# EAGLE design MotorModule (EAGLE 9.4.0)
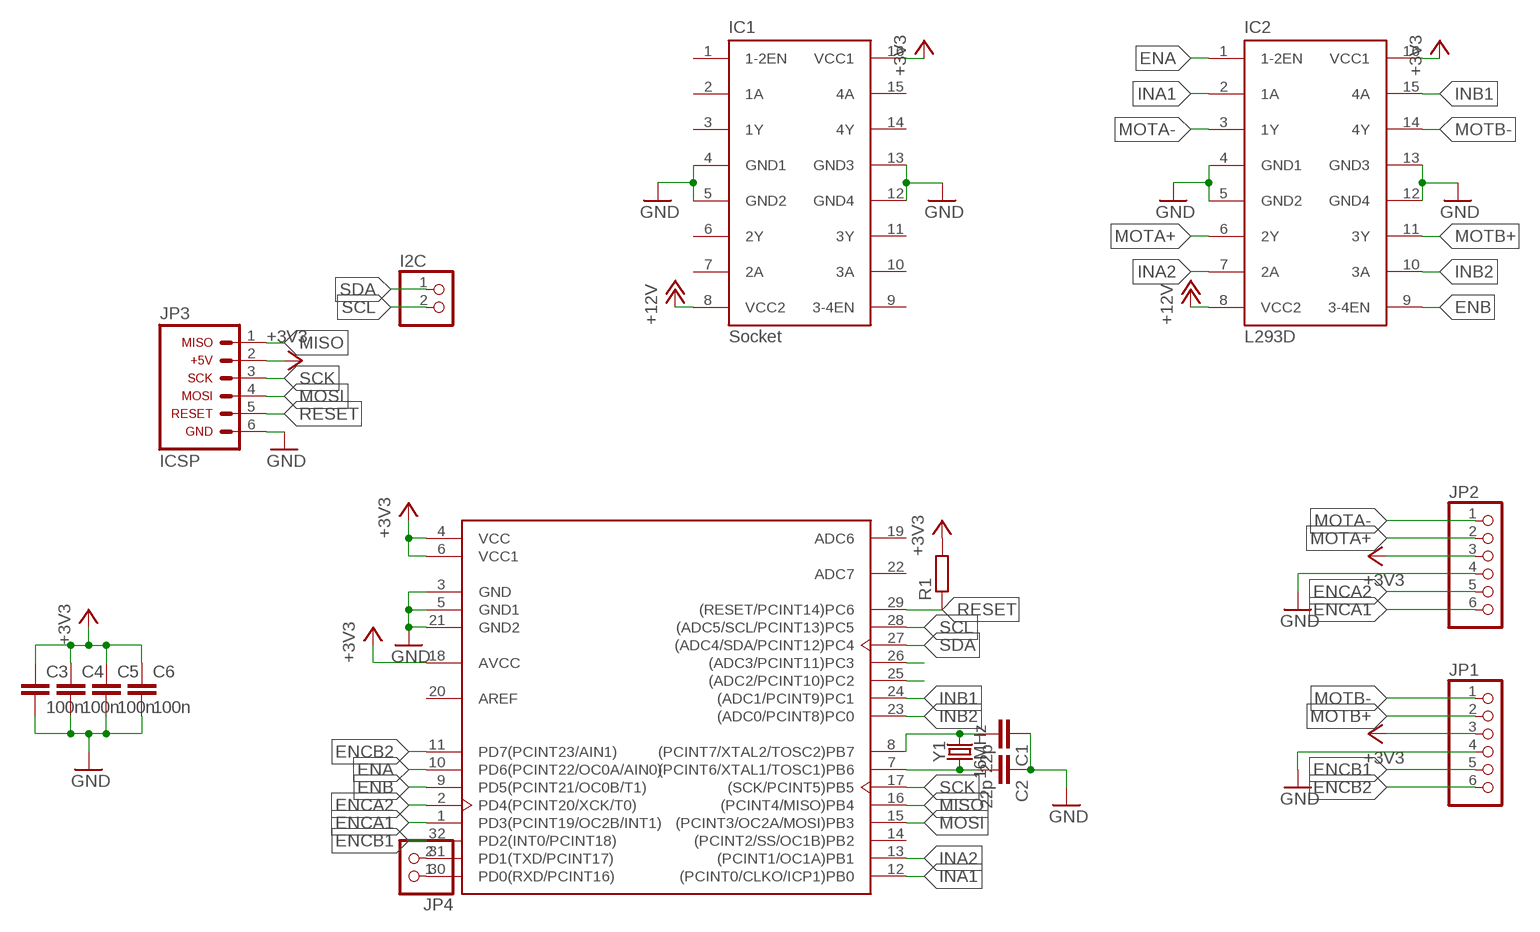
[diagram p0: schematic, sheet 1]

## Parts
C1  22p  C-EUC1206  [C1206]
C2  22p  C-EUC1206  [C1206]
C3  100n  C-EUC1206  [C1206]
C4  100n  C-EUC1206  [C1206]
C5  100n  C-EUC1206  [C1206]
C6  100n  C-EUC1206  [C1206]
I2C  PINHD-1X2  [1X02]
IC1  Socket  L293D  [L293]
IC2  L293D  [L293]
JP1  PINHD-1X6/90  [1X06/90]
JP2  PINHD-1X6/90  [1X06/90]
JP3  ICSP_HEADER  [ICSP_HEADER]
JP4  PINHD-1X2  [1X02]
R1  R-EU_M1206  [M1206]
U1  ATMEGA328P-AU  [TQFP-32]
Y1  16MHz  CRYSTAL-16MHZSMD-5X3.2  [CRYSTAL-SMD-5X3.2-4PAD]

## Nets
+3V3: C3.1 C4.1 C5.1 C6.1 IC1.16(VCC1) IC2.16(VCC1) JP1.3 JP2.3 JP3.2 R1.2 U1.4(VCC) U1.6(VCC1) U1.18(AVCC)
+12V: IC1.8(VCC2) IC2.8(VCC2)
ENA: IC2.1(1-2EN) U1.10(PD6(PCINT22/OC0A/AIN0))
ENB: IC2.9(3-4EN) U1.9(PD5(PCINT21/OC0B/T1))
ENCA1: JP2.6 U1.1(PD3(PCINT19/OC2B/INT1))
ENCA2: JP2.5 U1.2(PD4(PCINT20/XCK/T0))
ENCB1: JP1.5 U1.32(PD2(INT0/PCINT18))
ENCB2: JP1.6 U1.11(PD7(PCINT23/AIN1))
GND: C1.1 C2.1 C3.2 C4.2 C5.2 C6.2 IC1.4(GND1) IC1.5(GND2) IC1.12(GND4) IC1.13(GND3) IC2.4(GND1) IC2.5(GND2) IC2.12(GND4) IC2.13(GND3) JP1.4 JP2.4 JP3.6 U1.3(GND) U1.5(GND1) U1.21(GND2)
INA1: IC2.2(1A) U1.12((PCINT0/CLKO/ICP1)PB0)
INA2: IC2.7(2A) U1.13((PCINT1/OC1A)PB1)
INB1: IC2.15(4A) U1.24((ADC1/PCINT9)PC1)
INB2: IC2.10(3A) U1.23((ADC0/PCINT8)PC0)
MISO: JP3.1 U1.16((PCINT4/MISO)PB4)
MOSI: JP3.4 U1.15((PCINT3/OC2A/MOSI)PB3)
MOTA+: IC2.6(2Y) JP2.2
MOTA-: IC2.3(1Y) JP2.1
MOTB+: IC2.11(3Y) JP1.2
MOTB-: IC2.14(4Y) JP1.1
N$1: C1.2 U1.8((PCINT7/XTAL2/TOSC2)PB7) Y1.3
N$2: C2.2 U1.7((PCINT6/XTAL1/TOSC1)PB6) Y1.1
N$3: JP4.1 U1.30(PD0(RXD/PCINT16))
N$4: JP4.2 U1.31(PD1(TXD/PCINT17))
N$7: U1.25((ADC2/PCINT10)PC2)
N$8: U1.26((ADC3/PCINT11)PC3)
RESET: JP3.5 R1.1 U1.29((RESET/PCINT14)PC6)
SCK: JP3.3 U1.17((SCK/PCINT5)PB5)
SCL: I2C.2 U1.28((ADC5/SCL/PCINT13)PC5)
SDA: I2C.1 U1.27((ADC4/SDA/PCINT12)PC4)
Unconnected: IC1.1(1-2EN) IC1.2(1A) IC1.3(1Y) IC1.6(2Y) IC1.7(2A) IC1.9(3-4EN) IC1.10(3A) IC1.11(3Y) IC1.14(4Y) IC1.15(4A) U1.14((PCINT2/SS/OC1B)PB2) U1.19(ADC6) U1.22(ADC7)

## Power pins joined to a net without a drawn wire
AREF: U1.20(AREF)

## Library data of the parts
C1-C6 = rcl:C-EU: CAPACITOR, European symbol; SPICEPREFIX: C
I2C JP4 = pinhead:PINHD-1X2: PIN HEADER
IC1 IC2 = Cing Library:L293D: PUSH-PULL 4 CHANNEL DRIVER; MPN: L293D; OC_FARNELL: 9589619; OC_NEWARK: 56P8249
JP1 JP2 = pinhead:PINHD-1X6: PIN HEADER
JP3 = Cing Library:ICSP_HEADER: Arduino ICSP I/O Header This is the ICSP I/O header on the Arduino Uno R3. This connector is labeled with the following pin assignments: MISO +5V SCK MOSI RESET GND NOTE: Be sure you install this connector with the correct orientation on your PCB layout. Pin 1 has a square pad to assist with orientation.
R1 = rcl:R-EU_: RESISTOR, European symbol; SPICEPREFIX: R
U1 = Microcontroller:ATMEGA328P-AU: IC MCU 8BIT 32KB FLASH 32TQFP Manufacturer's datasheet <http://ww1.microchip.com/downloads/en/DeviceDoc/ATmega48A-PA-88A-PA-168A-PA-328-P-DS-DS40002061A.pdf>; CREATED_BY: PCBLayout.com; DIGIKEY_PART_NUMBER: ATMEGA328P-AU-ND; MANUFACTURER: Microchip Technology; MPN: ATMEGA328P-AU; PACKAGE: TQFP-32
Y1 = SparkFun-Clocks:CRYSTAL-16MHZ: 16MHz Crystal Digikey Example <http://www.digikey.com/product-search/en?keywords=535-9122-1-ND> Frequency: 16MHz Frequency Stability: ±50ppm Frequency Tolerance: ±20ppm Load Capacitance: 18pF SparkFun Products: Pro Micro -5V/16MHz <https://www.sparkfun.com/products/12640> SparkFun Serial Enabled LCD Kit <https://www.sparkfun.com/products/10097>; PROD_ID: XTAL-08218; SF_ID: COM-00094

## Board
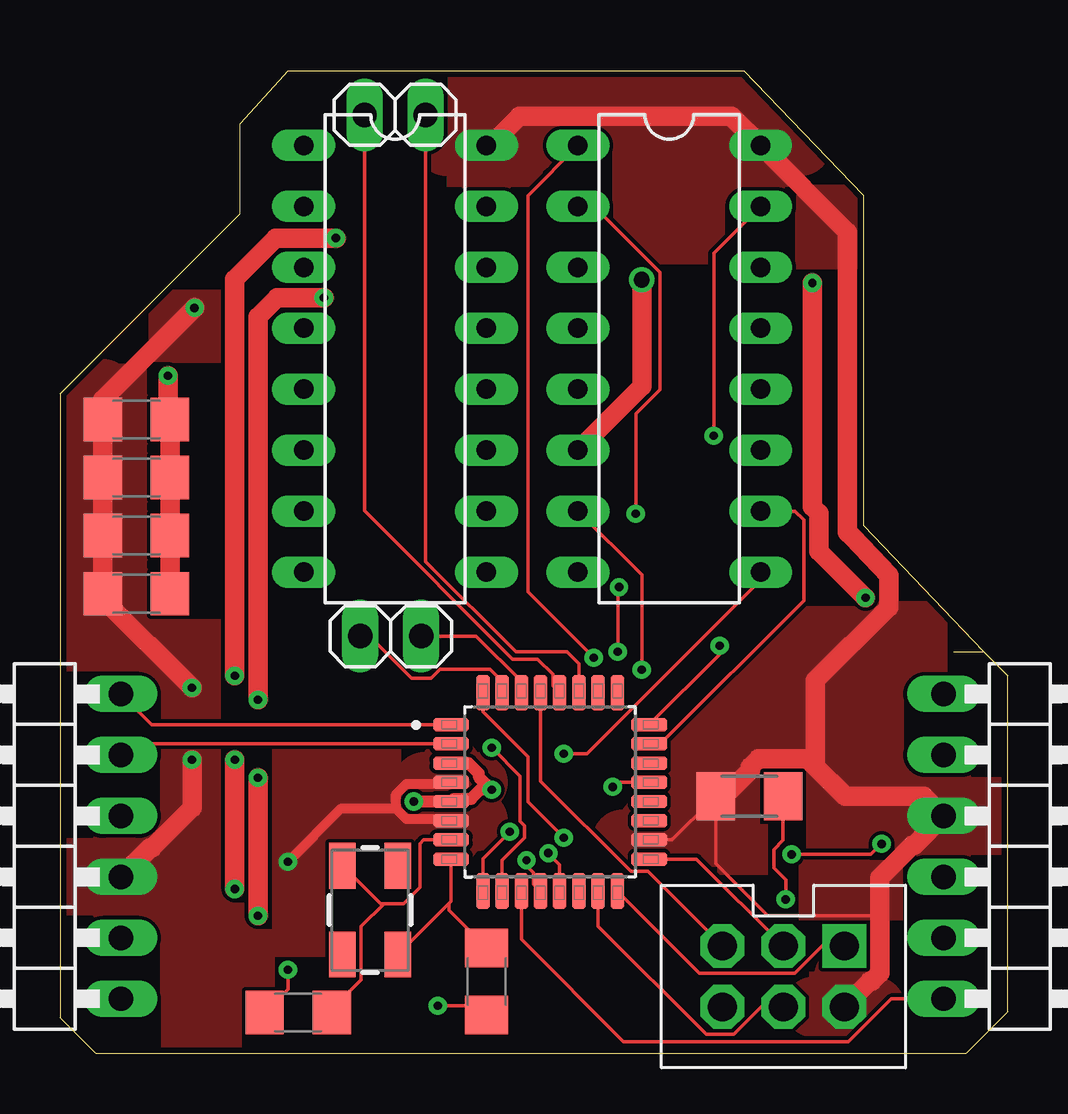
[diagram p1: board, top side]
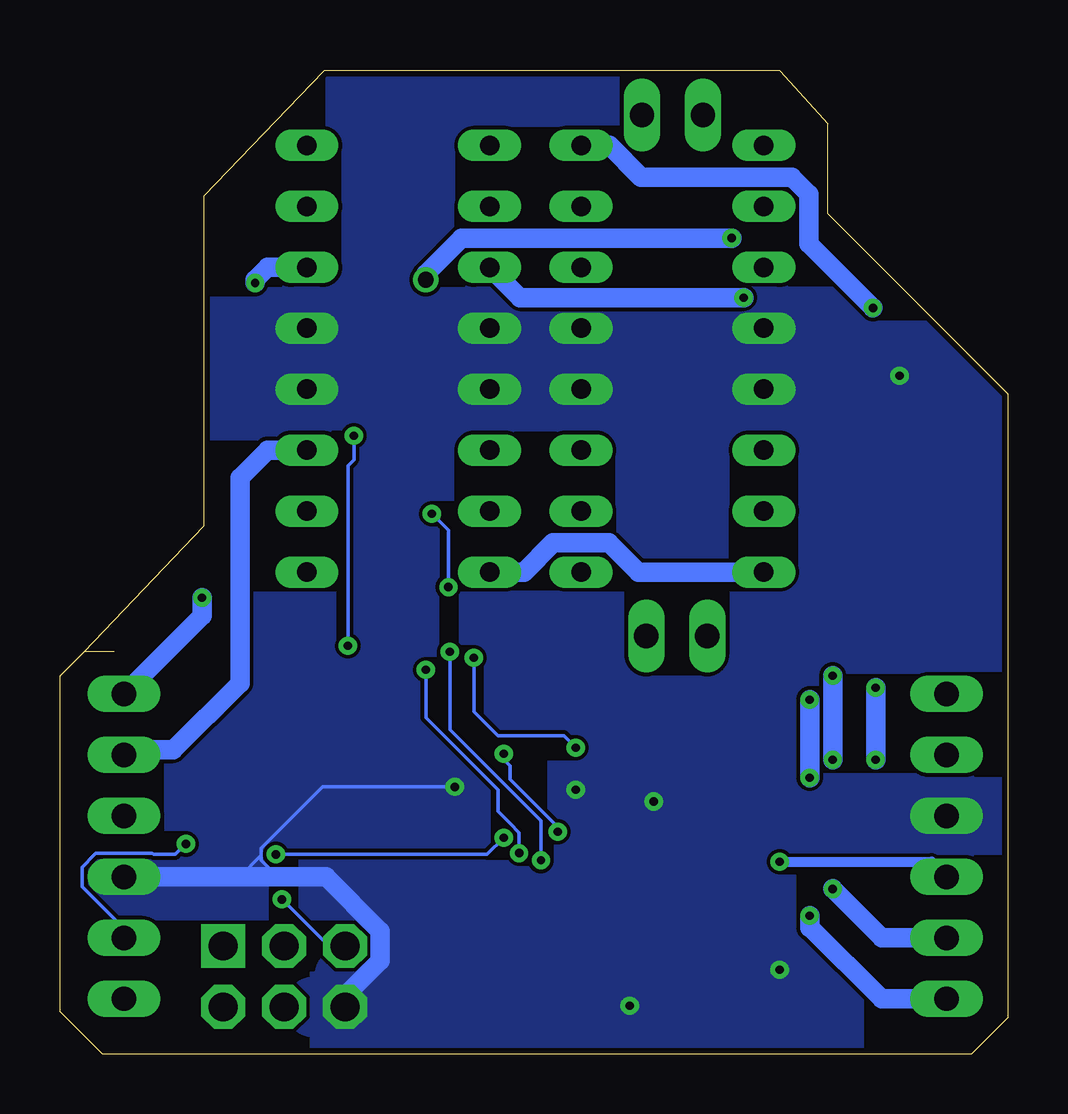
[diagram p2: board, bottom side, seen from below]

Size 39.5 x 40.95 mm. Coordinates in mm from the lower left corner, seen from the top.
Outline: 37.25,16.75 38.5,16.75
Outline: 38.5,16.75 39.5,15.75 39.5,1.75 37.75,0 1.5,0 0,1.5 0,27.5 7.5,35 7.5,38.75 9.5,40.95 28.5,40.95 33.5,35.75 33.5,22 38.5,16.75
Copper layers (1*16): Top 0.035mm / dielectric 1.5mm / Bottom 0.035mm
Design rules "default *": minimum track width 6mil, minimum drill 0.35mm, track to track 6mil, track to pad 6mil, pad to pad 6mil, via to via 6mil, smd to smd 6mil, copper to edge 10mil, drill to drill 6mil, minimum pad ring 10mil, minimum via ring 8mil, stop-mask expansion 4mil, vias tented up to drill 0mil, thermal gap 10mil

### Footprints (pad centres in the part's own frame; a part is rotated, then mirrored left to right if it is on the bottom)
C1206 = smd 1.6 x 1.8: 1 -1.4,0; 2 1.4,0
1X02 = drill 1.016 long: 1 -1.27,0; 2 1.27,0
L293 = drill 0.813 long: 1 -8.89,-3.81; 2 -6.35,-3.81; 3 -3.81,-3.81; 4 -1.27,-3.81; 5 1.27,-3.81; 6 3.81,-3.81; 7 6.35,-3.81; 8 8.89,-3.81; 9 8.89,3.81; 10 6.35,3.81; 11 3.81,3.81; 12 1.27,3.81; 13 -1.27,3.81; 14 -3.81,3.81; 15 -6.35,3.81; 16 -8.89,3.81
1X06/90 = drill 1.016 long: 1 -6.35,-3.81; 2 -3.81,-3.81; 3 -1.27,-3.81; 4 1.27,-3.81; 5 3.81,-3.81; 6 6.35,-3.81
ICSP_HEADER = drill 1.2 pad 1.829 square: 1 -1.27,2.54 | drill 1.2 pad 1.829 octagon: 2 1.27,2.54; 3 -1.27,0; 4 1.27,0; 5 -1.27,-2.54; 6 1.27,-2.54
M1206 = smd 1.6 x 2: 1 -1.4,0; 2 1.4,0
TQFP-32 = smd 0.57 x 1.5: 1 -2.8,-4.13; 2 -2,-4.13; 3 -1.2,-4.13; 4 -0.4,-4.13; 5 0.4,-4.13; 6 1.2,-4.13; 7 2,-4.13; 8 2.8,-4.13; 17 2.8,4.13; 18 2,4.13; 19 1.2,4.13; 20 0.4,4.13; 21 -0.4,4.13; 22 -1.2,4.13; 23 -2,4.13; 24 -2.8,4.13 | smd 1.5 x 0.57: 9 4.13,-2.8; 10 4.13,-2; 11 4.13,-1.2; 12 4.13,-0.4; 13 4.13,0.4; 14 4.13,1.2; 15 4.13,2; 16 4.13,2.8; 25 -4.13,2.8; 26 -4.13,2; 27 -4.13,1.2; 28 -4.13,0.4; 29 -4.13,-0.4; 30 -4.13,-1.2; 31 -4.13,-2; 32 -4.13,-2.8
CRYSTAL-SMD-5X3.2-4PAD = smd 1.9 x 1.1: 1 -1.85,-1.15; 2 1.85,-1.15; 3 1.85,1.15; 4 -1.85,1.15

### Placement (x,y rotation side)
C1  17.78,3.01 90 top
C2  9.93,1.72 0 top
C3  3.19,19.17 0 top
C4  3.19,21.59 0 top
C5  3.19,24.01 0 top
C6  3.19,26.43 0 top
I2C  13.97,39.12 180 top
IC1  13.97,28.96 270 top
IC2  25.4,28.96 270 top
JP1  40.64,8.64 270 top
JP2  -1.27,8.64 90 top
JP3  30.16,3.22 270 top
JP4  13.79,17.4 180 top
R1  28.74,10.73 180 top
U1  20.43,10.91 270 top
Y1  12.93,5.98 270 top

### Tracks (layer width: path | path; a pad name or v marks a point on that pad's centre or on a via)
+3V3  (via drill 0.35)
  Top 0.152: U1.18 25.52,8.91 27.18,10.57 | R1.2 27.34,7.91 29.5,5.75 34.17,5.75
  Top 0.406: 14.02,10.21 14.45,9.78 16.23,9.78 U1.6 | 14.02,10.21 14.02,10.81 14.45,11.24 16.23,11.24 U1.4 | 14.02,10.21 11.71,10.21 v9.5,8
  Top 0.61: 27.69,10.73 R1.2
  Top 0.813: JP3.2 33.77,3.02 33.85,3.02 34.17,3.34 34.17,5.75 34.17,7.34 35.52,8.69 35.61,8.69 JP1.3 36.01,10.73 32.73,10.73 31.5,11.96 | JP2.3 3.76,8.59 3.85,8.59 5.5,10.24 v5.5,12.25 | v5.5,15.25 1.79,18.96 C3.1 C4.1 C5.1 C6.1 1.79,27.25 v5.61,31.08 | 31.5,11.96 31.5,15.55 34.55,18.6 34.55,19.95 33.03,21.54 32.83,21.73 32.83,34.23 IC2.16 27.99,39.07 19.16,39.07 17.9,37.82 17.87,37.85 IC1.16 | 31.5,11.96 31.17,12.29 29.11,12.29 28.78,11.96 28.78,11.82 27.69,10.73 | R1.2 27.18,10.57
  Bottom 0.406: v9.5,8 3.17,8 JP2.3
  Bottom 0.813: v5.5,12.25 v5.5,15.25 | IC1.16 16.6,37.85 15.28,36.53 8.99,36.53 8.28,35.81 8.28,33.75 v5.61,31.08
  pour Top: -10,49.75 50,49.75 50,-10.25 -10,-10.25
+12V
  Bottom 0.813: IC1.8 15.39,20.07 16.62,21.29 18.95,21.29 20.16,20.07 IC2.8
ENA  (via drill 0.35)
  Top 0.152: U1.10 18.43,8.07 19.36,9 19.36,9.5 19.18,9.68 19.18,11.57 v18,12.75 | IC2.1 19.5,35.76 19.5,19.25 v22.25,16.5
  Bottom 0.152: v22.25,16.5 22.25,14.25 21.25,13.25 18.5,13.25 v18,12.75
ENB  (via drill 0.35)
  Top 0.152: IC2.9 29.21,19.74 21.97,12.5 v21,12.5 | v18.75,9.25 17.63,8.13 U1.9
  Bottom 0.152: v21,12.5 21,12.25 20.75,12 20.75,11.43 18.75,9.43 v18.75,9.25
ENCA1
  Top 0.152: U1.1 3.82,13.71 JP2.6
ENCA2
  Top 0.152: U1.2 3,12.91 JP2.5
ENCB1  (via drill 0.35)
  Top 0.152: U1.32 17.63,14.25 19.5,12.38 19.5,10.5 v21,9 | v34.25,8.75 33.81,8.31 v30.5,8.31
  Bottom 0.152: JP1.5 36.83,5.21 38.58,6.96 38.58,7.78 38.06,8.31 38,8.36 35.66,8.36 35.6,8.31 34.69,8.31 v34.25,8.75 | v30.5,8.31 21.69,8.31 v21,9
ENCB2
  Top 0.152: JP1.6 34.66,2.29 32.87,0.5 23.5,0.5 19.23,4.77 U1.11
GND  (via drill 0.35)
  Top 0.152: 17.99,11.01 v18,11 | C1.1 17.39,2 v15.75,2 | C2.1 9.5,2.69 v9.5,3.5 | 24.62,11.25 U1.21 23.23,11.31 v23.04,11.12
  Top 0.508: 17.99,11.01 17.53,11.01 17.14,10.62 16.41,10.62 U1.5 v14.75,10.51 | v18,11 17.46,11.54 17.46,11.68 17.03,12.11 U1.3
  Top 0.813: C3.2 C4.2 C5.2 C6.2 4.5,26.52 v4.5,28.25
  Bottom 0.152: 31.11,8.26 31.11,8.06 30.75,7.7 28.75,7.7 28.42,7.37 | 32,7.37 31.11,8.26 | 31.11,8.26 31.11,8.56 28.55,11.12 v23.04,11.12
  Bottom 0.813: JP3.6 27.62,2.41 26.15,3.88 26.15,5.1 28.42,7.37 32,7.37 JP1.4
  pour Bottom: -10,49.75 50,49.75 50,-10.25 -10,-10.25
INA1  (via drill 0.35)
  Top 0.152: U1.12 19.74,7.07 19.74,7.54 19.45,7.84 v19.45,8.06 | v23.25,16.75 23.25,19.39 v23.31,19.44 | v24,22.5 24,26.66 25.01,27.67 25.01,32.56 22.26,35.31 IC2.2
  Bottom 0.152: v19.45,8.06 19.45,9.7 23.25,13.5 v23.25,16.75 | v23.31,19.44 23.31,21.81 v24,22.5
INA2  (via drill 0.35)
  Top 0.152: IC2.7 24.25,19.95 v24.25,16 | v20.36,8.36 20.83,7.88 U1.13
  Bottom 0.152: v20.36,8.36 20.36,9.22 20.75,9.61 21.25,10.11 21.25,11 24.25,14 v24.25,16
INB1  (via drill 0.35)
  Top 0.152: U1.24 27.5,16.65 v27.5,17 | v27.25,25.75 27.25,33.35 IC2.15
  Bottom 0.152: v27.5,17 27.5,24.5 27.25,24.75 v27.25,25.75
INB2
  Top 0.152: IC2.10 30.64,22.61 31,22.25 31,18.87 25.04,12.91 U1.23
MISO
  Top 0.152: JP3.1 31.78,4.49 30.63,3.35 26.66,3.35 U1.16
MOSI
  Top 0.152: JP3.4 29.24,1.95 28.09,0.81 26.94,0.81 22.43,5.32 U1.15
MOTA+  (via drill 0.35, 0.65)
  Top 0.813: v24.25,32.25 24.25,27.81 IC2.6 | v7.29,6.87 v7.29,12.25 | v11.5,33.99 8.99,33.99 7.29,32.28 v7.29,15.75
  Bottom 0.813: v24.25,32.25 24.25,32.49 22.75,33.99 v11.5,33.99 | JP2.2 5.25,4.83 v7.29,6.87 | v7.29,12.25 v7.29,15.75
MOTA-  (via drill 0.35)
  Top 0.813: v8.25,11.5 v8.25,5.75 | v11,31.5 9.04,31.5 8.25,30.7 v8.25,14.75
  Bottom 0.813: IC2.3 20.32,31.5 v11,31.5 | JP2.1 5.25,2.29 8.21,5.25 8.25,5.25 v8.25,5.75 | v8.25,11.5 v8.25,14.75
MOTB+
  Bottom 0.813: JP1.2 36.61,12.67 34.77,12.67 32,15.44 32,24 30.85,25.15 IC2.11
MOTB-  (via drill 0.35)
  Top 0.813: v33.58,19 31.63,20.95 31.63,22.51 31.37,22.78 v31.37,32.12
  Bottom 0.813: JP1.1 33.58,18.24 v33.58,19 | v31.37,32.12 31.37,32.25 30.84,32.77 IC2.14
N$1
  Top 0.152: U1.8 16.3,6.36 16.22,6.28 | 16.22,6.28 Y1.3 | C1.2 16.22,5.97 16.22,6.28
N$2
  Top 0.152: Y1.1 13.36,6.25 13.5,6.25 | U1.7 15.16,8.91 15,8.75 15,6.94 14.31,6.25 13.5,6.25 | 13.5,6.25 12.55,5.3 12.55,3.09 11.33,1.87 C2.2
N$3
  Top 0.152: JP4.1 17.35,17.4 19.23,15.52 U1.30
N$4
  Top 0.152: JP4.2 12.9,17.4 14.65,15.65 15.47,15.65 15.84,16.02 17.93,16.02 18.43,15.52 U1.31
RESET  (via drill 0.35)
  Top 0.152: JP3.5 24.51,7.6 23.8,7.6 20.03,11.36 U1.29 | v30.25,6.43 30.25,7.25 29.75,7.75 29.75,8.5 30.14,8.89 R1.1
  Bottom 0.152: v30.25,6.43 28.31,4.49 JP3.5
SCK
  Top 0.152: JP3.3 26.54,8.11 U1.17
SCL
  Top 0.152: U1.28 20.54,15.33 20.54,15.8 19.9,16.45 18.87,16.45 12.7,22.62 I2C.2
SDA
  Top 0.152: I2C.1 15.24,20.51 19,16.75 21.13,16.75 21.63,16.25 U1.27